# EAGLE design Group_11 (EAGLE 9.6.2)
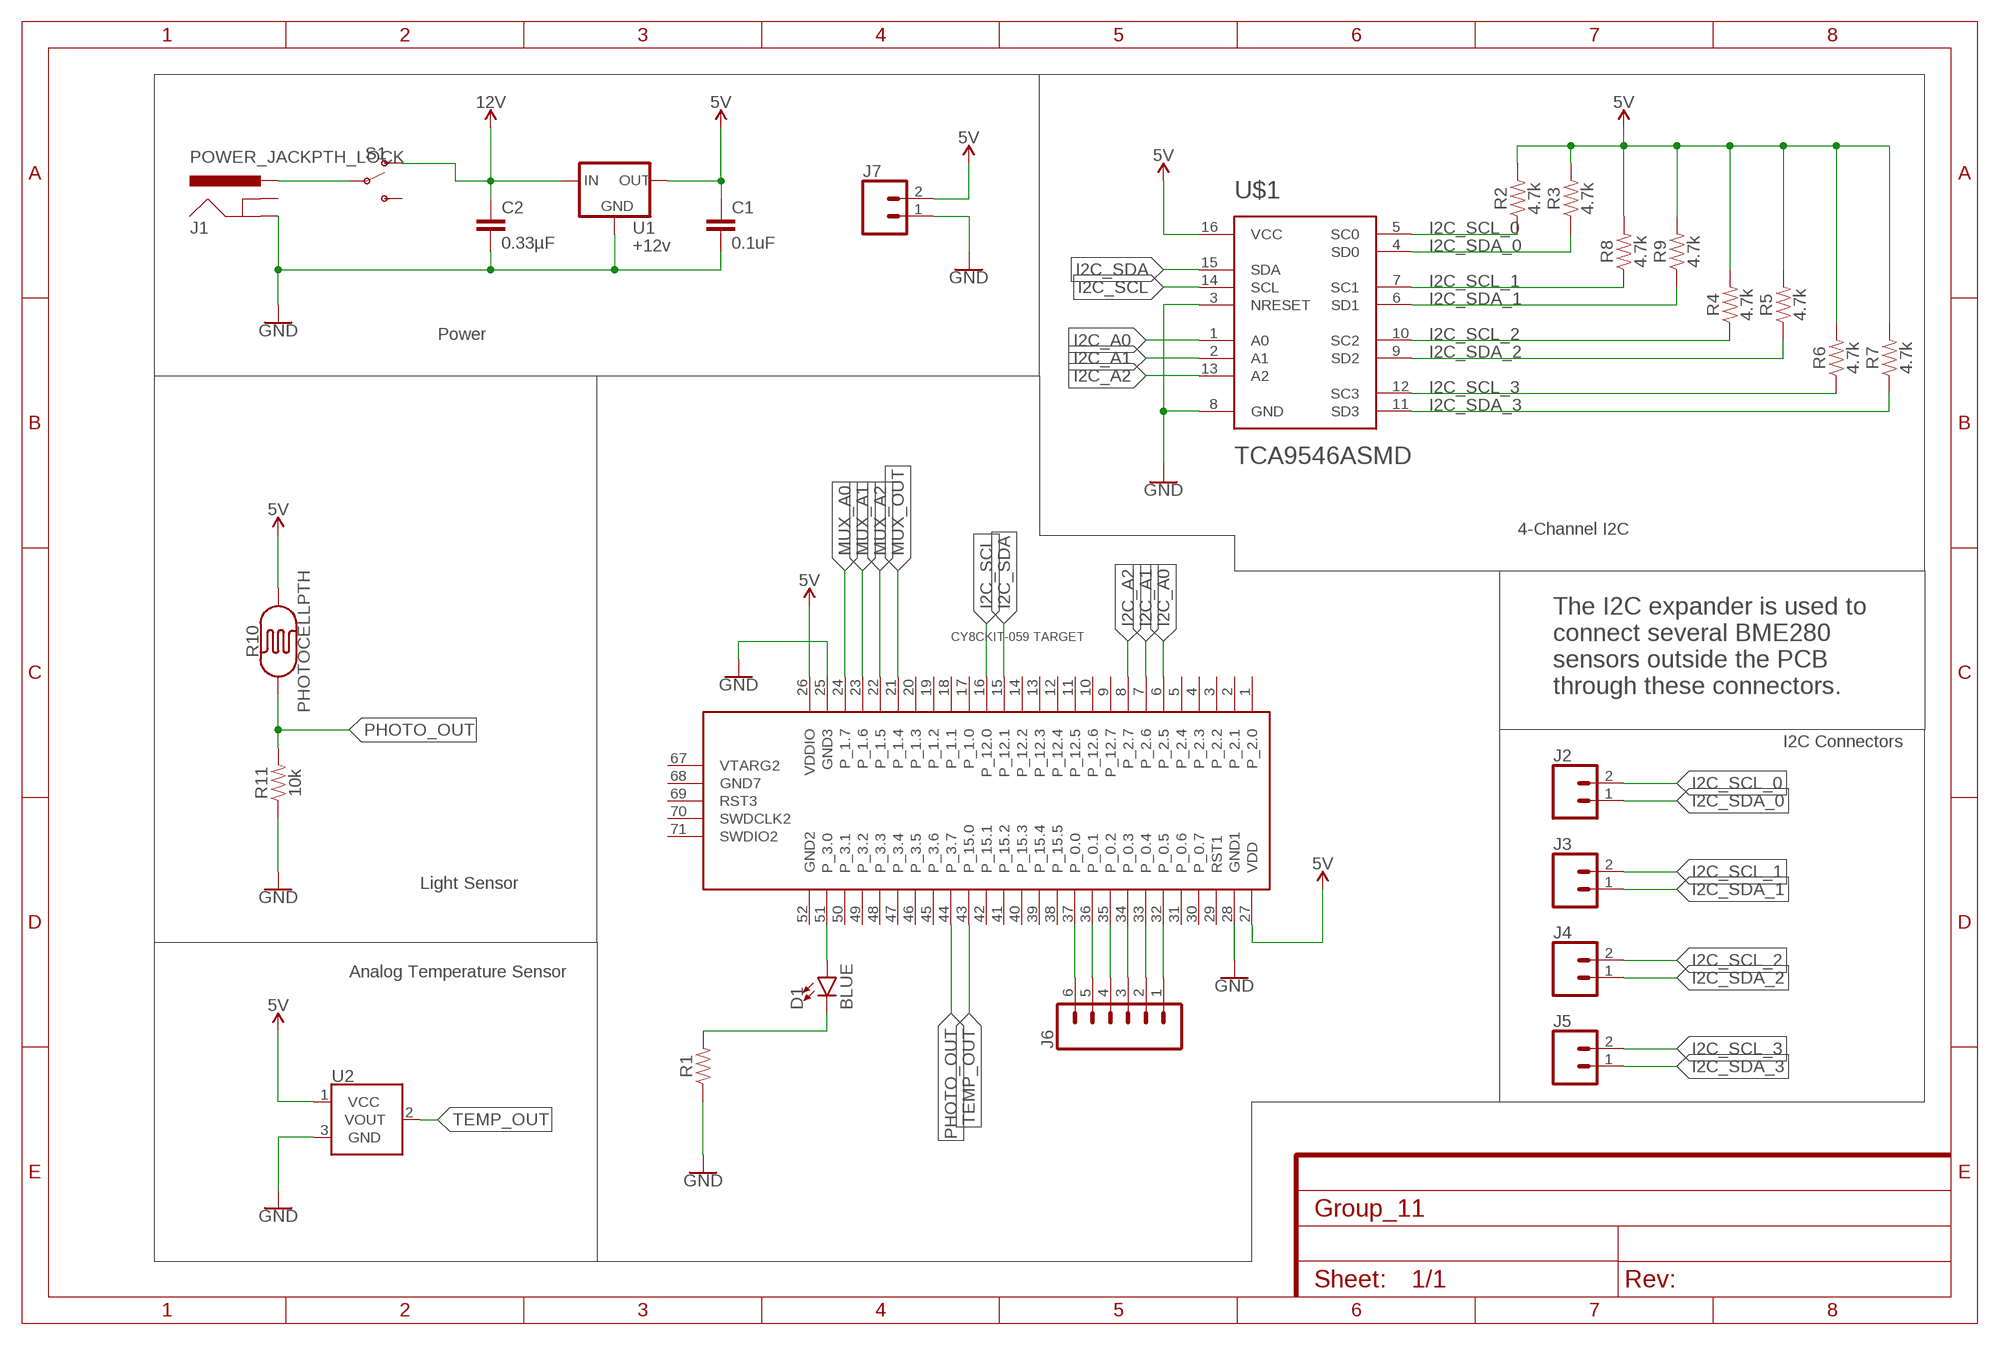
[diagram p0: schematic, sheet 1, part 1 of 2]
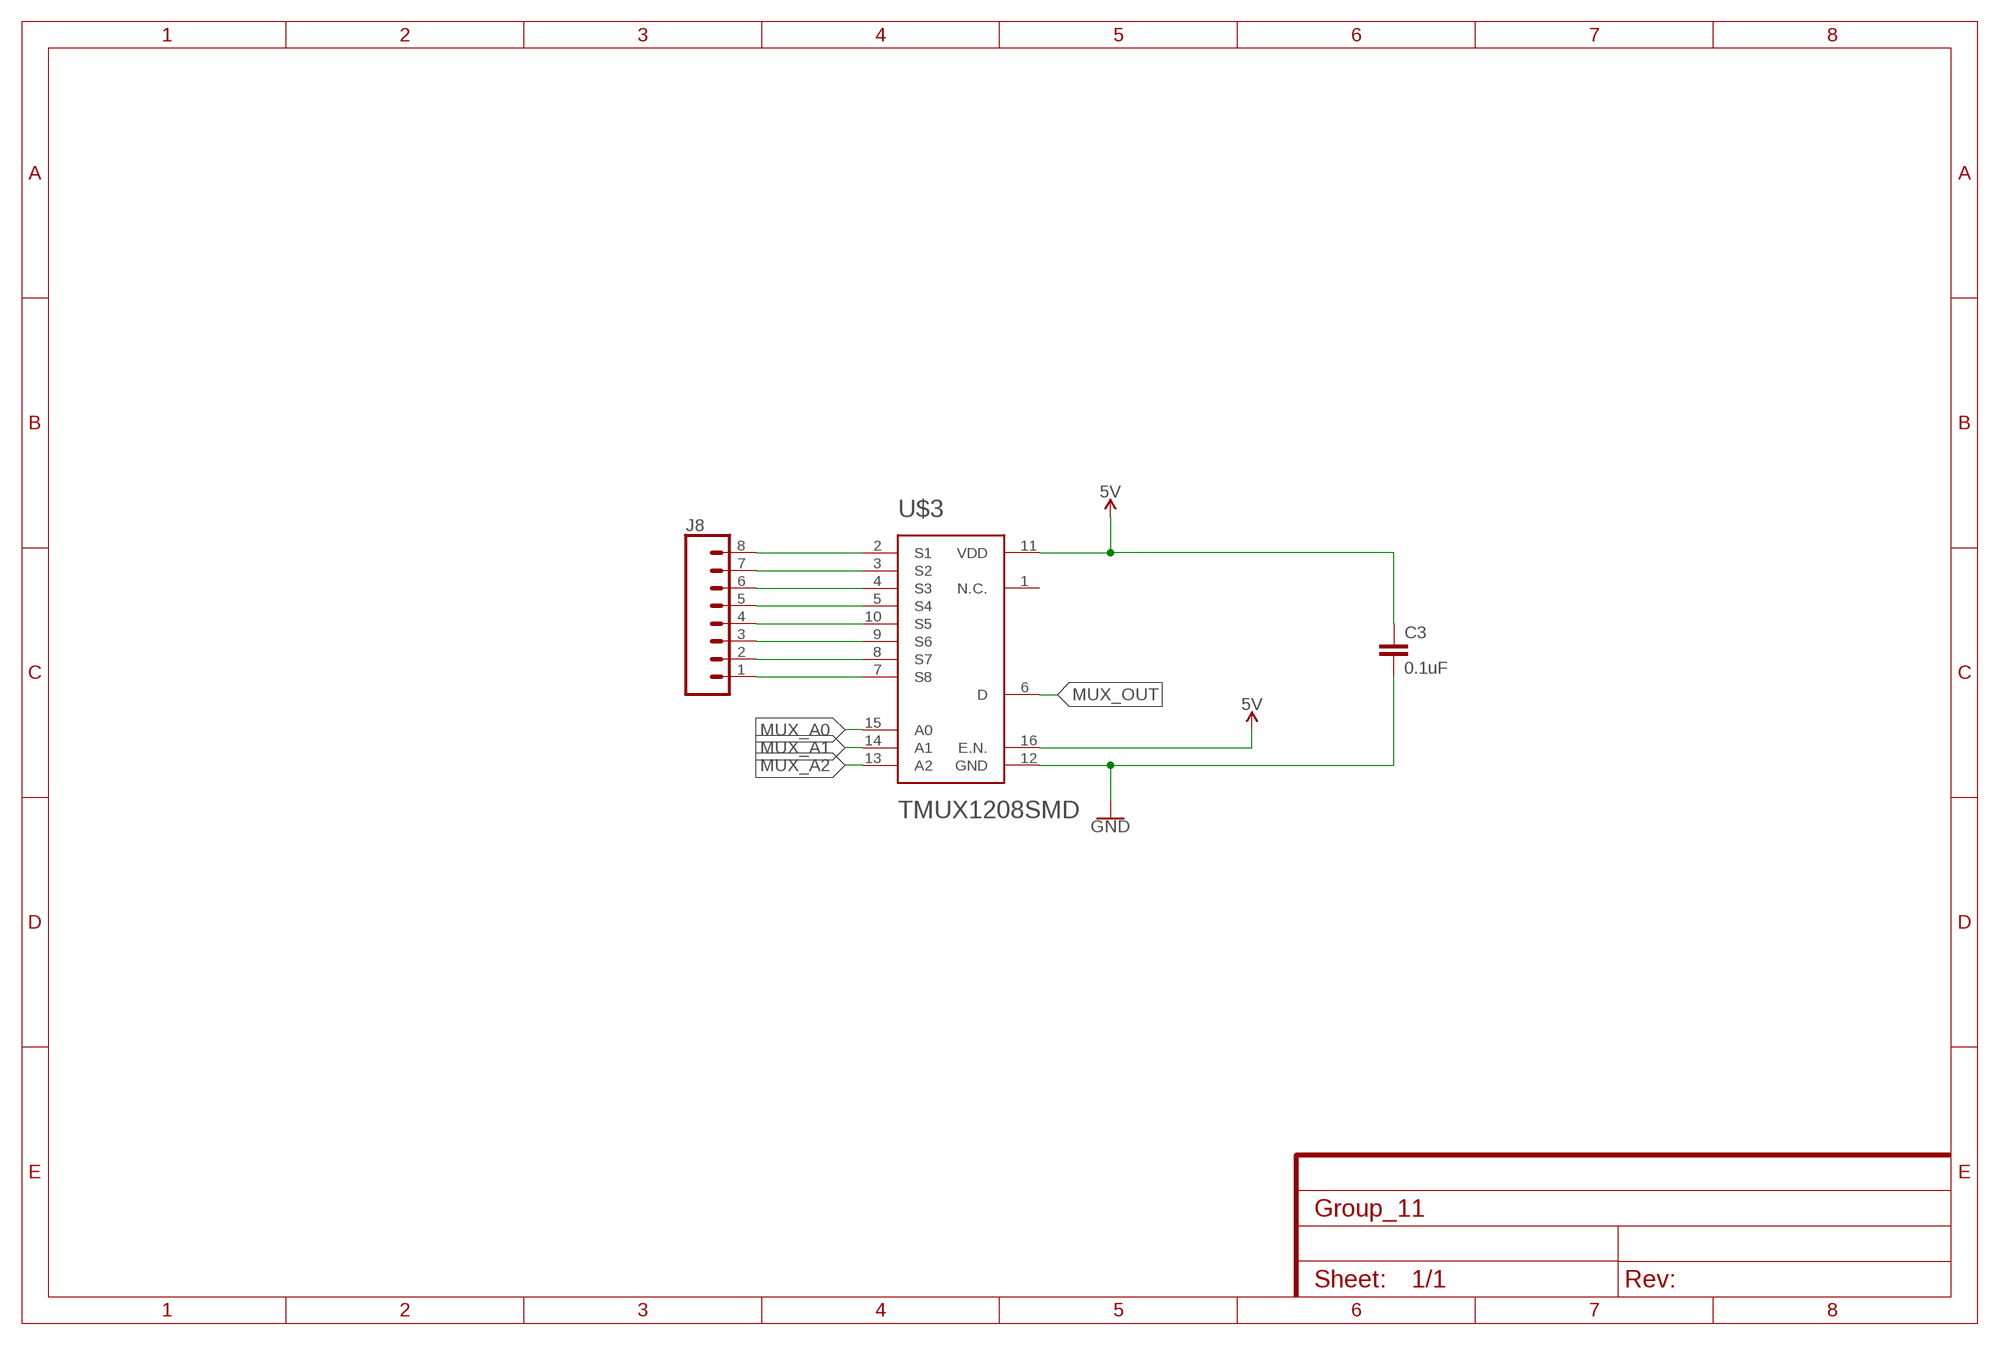
[diagram p1: schematic, sheet 1, part 2 of 2]

## Parts
C1  0.1uF  0.1UF-KIT-EZ-50V-20%  [CAP-PTH-SMALL-KIT]
C2  0.33µF  0.33UF/330NF-0805-50V-10%  [0805]
C3  0.1uF  0.1UF-KIT-EZ-50V-20%  [CAP-PTH-SMALL-KIT]
D1  BLUE  LED-BLUE1206  [LED-1206]
J1  POWER_JACKPTH_LOCK  [POWER_JACK_PTH_LOCK]
J2  CONN_02  [1X02]
J3  CONN_02  [1X02]
J4  CONN_02  [1X02]
J5  CONN_02  [1X02]
J6  CONN_06LOCK  [1X06_LOCK]
J7  CONN_02  [1X02]
J8  CONN_08LOCK  [1X08_LOCK]
R1  RESISTORAXIAL-0.3  [AXIAL-0.3]
R2  4.7k  4.7KOHM-0603-1/10W-1%  [0603]
R3  4.7k  4.7KOHM-0603-1/10W-1%  [0603]
R4  4.7k  4.7KOHM-0603-1/10W-1%  [0603]
R5  4.7k  4.7KOHM-0603-1/10W-1%  [0603]
R6  4.7k  4.7KOHM-0603-1/10W-1%  [0603]
R7  4.7k  4.7KOHM-0603-1/10W-1%  [0603]
R8  4.7k  4.7KOHM-0603-1/10W-1%  [0603]
R9  4.7k  4.7KOHM-0603-1/10W-1%  [0603]
R10  PHOTOCELLPTH  [PHOTOCELL]
R11  10k  10KOHM-0603-1/10W-1%  [0603]
S1  SWITCH-SPDT-PTH-11.6X4.0MM  [SWITCH_SPDT_PTH_11.6X4.0MM]
U1  +12v  V_REG_78XX7812  [TO-252]
U2  TMP36GT9  [TO-92]
U$1  TCA9546ASMD  [TSSOP-16]
U$2  CY8CKIT-059_TARGET  [CY8CKIT-059_TARGET]
U$3  TMUX1208SMD  [QFN16]

## Nets
5V: C1.1 C3.1 J7.2 R2.2 R3.2 R4.2 R5.2 R6.2 R7.2 R8.2 R9.2 R10.2 U1.2(OUT) U2.1(VCC) U$1.16(VCC) U$2.26(VDDIO) U$2.27(VDD) U$3.11(VDD) U$3.16(E.N.)
12V: C2.1 S1.1(O) U1.1(IN)
GND: C1.2 C2.2 C3.2 J1.GND J7.1 R1.P$1 R11.1 U1.3(GND) U2.3(GND) U$1.3(NRESET) U$1.8(GND) U$2.25(GND3) U$2.28(GND1) U$3.12(GND)
I2C_A0: U$1.1(A0) U$2.6(P_2.5)
I2C_A1: U$1.2(A1) U$2.7(P_2.6)
I2C_A2: U$1.13(A2) U$2.8(P_2.7)
I2C_SCL: U$1.14(SCL) U$2.16(P_12.0)
I2C_SCL_0: J2.2 R2.1 U$1.5(SC0)
I2C_SCL_1: J3.2 R8.1 U$1.7(SC1)
I2C_SCL_2: J4.2 R4.1 U$1.10(SC2)
I2C_SCL_3: J5.2 R6.1 U$1.12(SC3)
I2C_SDA: U$1.15(SDA) U$2.15(P_12.1)
I2C_SDA_0: J2.1 R3.1 U$1.4(SD0)
I2C_SDA_1: J3.1 R9.1 U$1.6(SD1)
I2C_SDA_2: J4.1 R5.1 U$1.9(SD2)
I2C_SDA_3: J5.1 R7.1 U$1.11(SD3)
MUX_A0: U$2.24(P_1.7) U$3.15(A0)
MUX_A1: U$2.23(P_1.6) U$3.14(A1)
MUX_A2: U$2.22(P_1.5) U$3.13(A2)
MUX_OUT: U$2.21(P_1.4) U$3.6(D)
N$1: J8.8 U$3.2(S1)
N$2: D1.C R1.P$2
N$3: D1.A U$2.51(P_3.0)
N$4: J6.6 U$2.37(P_0.0)
N$5: J6.5 U$2.36(P_0.1)
N$6: J6.4 U$2.35(P_0.2)
N$7: J6.3 U$2.34(P_0.3)
N$8: J6.2 U$2.33(P_0.4)
N$9: J1.PWR S1.2(P)
N$10: J8.7 U$3.3(S2)
N$11: J8.1 U$3.7(S8)
N$12: J8.2 U$3.8(S7)
N$13: J8.3 U$3.9(S6)
N$14: J8.4 U$3.10(S5)
N$15: J8.5 U$3.5(S4)
N$16: J8.6 U$3.4(S3)
N$17: J6.1 U$2.32(P_0.5)
PHOTO_OUT: R10.1 R11.2 U$2.44(P_3.7)
TEMP_OUT: U2.2(VOUT) U$2.43(P_15.0)
Unconnected: J1.GNDBREAK S1.3(S) U$2.1(P_2.0) U$2.2(P_2.1) U$2.3(P_2.2) U$2.4(P_2.3) U$2.5(P_2.4) U$2.9(P_12.7) U$2.10(P_12.6) U$2.11(P_12.5) U$2.12(P_12.4) U$2.13(P_12.3) U$2.14(P_12.2) U$2.17(P_1.0) U$2.18(P_1.1) U$2.19(P_1.2) U$2.20(P_1.3) U$2.29(RST1) U$2.30(P_0.7) U$2.31(P_0.6) U$2.38(P_15.5) U$2.39(P_15.4) U$2.40(P_15.3) U$2.41(P_15.2) U$2.42(P_15.1) U$2.45(P_3.6) U$2.46(P_3.5) U$2.47(P_3.4) U$2.48(P_3.3) U$2.49(P_3.2) U$2.50(P_3.1) U$2.52(GND2) U$2.67(VTARG2) U$2.68(GND7) U$2.69(RST3) U$2.70(SWDCLK2) U$2.71(SWDIO2) U$3.1(N.C.)

## Notes on the sheet
- Power
- 4-Channel I2C
- The I2C expander is used to 
  connect several BME280 
  sensors outside the PCB 
  through these connectors.
- I2C Connectors
- Light Sensor
- Analog Temperature Sensor

## Library data of the parts
C1 C3 = SparkFun-Capacitors:0.1UF: 0.1µF ceramic capacitors A capacitor is a passive two-terminal electrical component used to store electrical energy temporarily in an electric field.; PROD_ID: CAP-08370
C2 = SparkFun-Capacitors:0.33UF/330NF: 0.33µF/330nF ceramic capacitors A capacitor is a passive two-terminal electrical component used to store electrical energy temporarily in an electric field.; PROD_ID: CAP-08469
D1 = SparkFun-LED:LED-BLUE: Blue SMD LED Used in manufacturing of various products at SparkFun Packages: 0603 - SMD 0603 package [Product Link] <http://www.digikey.com/product-detail/en/SMLE12BC7TT86/511-1589-2-ND/1641808> 1206 - SMD1206 package [Product Link] <http://www.digikey.com/product-detail/en/lite-on-inc/LTST-C150TBKT/160-1643-1-ND/573584> SparkFun Products: ESP8266 Thing-Dev Board <https://www.sparkfun.com/products/13711> RedBoard <https://www.sparkfun.com/products/12757>; PROD_ID: DIO-09911
J1 = SparkFun-Connectors:POWER_JACK: Power Jack Connector This is the standard 5.5mm barrel jack for power. The PTH is the most common, proven, reliable, footprint. The Slot footprint only works if the mill layer is transmitted to the PCB fab house so be warned. Here are the connectors we sell at SparkFun: DC Barrel Power Jack/Connector <https://www.sparkfun.com/products/119> (PRT-00119) DC Barrel Power Jack/Connector (SMD) <https://www.sparkfun.com/products/12748> (PRT-12748) DC Barrel Jack Adapter - Breadboard Compatible <https://www.sparkfun.com/products/10811> (PRT-10811) It is used on this SparkFun product (and many, many others): SparkFun RedBoard - Programmed with Arduino <https://www.sparkfun.com/products/12757> (DEV-12757) Also, if you need a mating power supply or connector, please check these out: Wall Adapter Power Supply - 9VDC 650mA <https://www.sparkfun.com/products/298> (TOL-00298) DC Barrel Jack Adapter - Male <https://www.sparkfun.com/products/10287> (PRT-10287); PROD_ID: CONN-08197; SF_ID: PRT-00119
J2-J5 J7 = SparkFun-Connectors:CONN_02: Multi connection point. Often used as Generic Header-pin footprint for 0.1 inch spaced/style header connections On any of the 0.1 inch spaced packages, you can populate with these: Break Away Headers - Straight <https://www.sparkfun.com/products/116> (PRT-00116) Break Away Male Headers - Right Angle <https://www.sparkfun.com/products/553> (PRT-00553) Female Headers <https://www.sparkfun.com/products/115> (PRT-00115) Break Away Headers - Machine Pin <https://www.sparkfun.com/products/117> (PRT-00117) Break Away Female Headers - Swiss Machine Pin <https://www.sparkfun.com/products/743> (PRT-00743) For SCREWTERMINALS and SPRING TERMINALS visit here: Screw Terimnals on SparkFun.com <https://www.sparkfun.com/search/results?term=Screw+Terminals> (5mm/3.5mm/2.54mm spacing) This device is also useful as a general connection point to wire up your design to another part of your project. Our various solder wires solder well into these plated through hole pads. Hook-Up Wire - Assortment (Stranded, 22 AWG) <https://www.sparkfun.com/products/11375> (PRT-11375) Hook-Up Wire - Assortment (Solid Core, 22 AWG) <https://www.sparkfun.com/products/11367> (PRT-11367) View the entire wire category on our website here <https://www.sparkfun.com/categories/141> Special notes: Molex polarized connector foot print use with: PRT-08233 with associated crimp pins and housings. 2.54_SCREWTERM for use with PRT-10571. 3.5mm Screw Terminal footprints for PRT-08084 5mm Screw Terminal footprints for use with PRT-08432
J6 = SparkFun-Connectors:CONN_06: Multi connection point. Often used as Generic Header-pin footprint for 0.1 inch spaced/style header connections On any of the 0.1 inch spaced packages, you can populate with these: Break Away Headers - Straight <https://www.sparkfun.com/products/116> (PRT-00116) Break Away Male Headers - Right Angle <https://www.sparkfun.com/products/553> (PRT-00553) Female Headers <https://www.sparkfun.com/products/115> (PRT-00115) Break Away Headers - Machine Pin <https://www.sparkfun.com/products/117> (PRT-00117) Break Away Female Headers - Swiss Machine Pin <https://www.sparkfun.com/products/743> (PRT-00743) Arduino Stackable Header - 6 Pin <https://www.sparkfun.com/products/9280> (PRT-09280) For SCREWTERMINALS and SPRING TERMINALS visit here: Screw Terimnals on SparkFun.com <https://www.sparkfun.com/search/results?term=Screw+Terminals> (5mm/3.5mm/2.54mm spacing) This device is also useful as a general connection point to wire up your design to another part of your project. Our various solder wires solder well into these plated through hole pads. Hook-Up Wire - Assortment (Stranded, 22 AWG) <https://www.sparkfun.com/products/11375> (PRT-11375) Hook-Up Wire - Assortment (Solid Core, 22 AWG) <https://www.sparkfun.com/products/11367> (PRT-11367) View the entire wire category on our website here <https://www.sparkfun.com/categories/141>
J8 = SparkFun-Connectors:CONN_08: Multi connection point. Often used as Generic Header-pin footprint for 0.1 inch spaced/style header connections On any of the 0.1 inch spaced packages, you can populate with these: Break Away Headers - Straight <https://www.sparkfun.com/products/116> (PRT-00116) Break Away Male Headers - Right Angle <https://www.sparkfun.com/products/553> (PRT-00553) Female Headers <https://www.sparkfun.com/products/115> (PRT-00115) Break Away Headers - Machine Pin <https://www.sparkfun.com/products/117> (PRT-00117) Break Away Female Headers - Swiss Machine Pin <https://www.sparkfun.com/products/743> (PRT-00743) Arduino Stackable Header - 8 Pin <https://www.sparkfun.com/products/9279> (PRT-09279) For SCREWTERMINALS and SPRING TERMINALS visit here: Screw Terimnals on SparkFun.com <https://www.sparkfun.com/search/results?term=Screw+Terminals> (5mm/3.5mm/2.54mm spacing) This device is also useful as a general connection point to wire up your design to another part of your project. Our various solder wires solder well into these plated through hole pads. Hook-Up Wire - Assortment (Stranded, 22 AWG) <https://www.sparkfun.com/products/11375> (PRT-11375) Hook-Up Wire - Assortment (Solid Core, 22 AWG) <https://www.sparkfun.com/products/11367> (PRT-11367) View the entire wire category on our website here <https://www.sparkfun.com/categories/141> Special notes: Molex polarized connector foot print use with SKU : PRT-08231 with associated crimp pins and housings. 1MM SMD Version SKU: PRT-10208 NOTES ON THE VARIANTS LOCK and LOCK_LONGPADS... This footprint was designed to help hold the alignment of a through-hole component (i.e. 6-pin header) while soldering it into place. You may notice that each hole has been shifted either up or down by 0.005 of an inch from it's more standard position (which is a perfectly straight line). This slight alteration caused the pins (the squares in the middle) to touch the edges of the holes. Because they are alternating, it causes a "brace" to hold the component in place. 0.005 has proven to be the perfect amount of "off-center" position when using our standard breakaway headers. Although looks a little odd when you look at the bare footprint, once you have a header in there, the alteration is very hard to notice. Also,if you push a header all the way into place, it is covered up entirely on the bottom side.
R1 = SparkFun-Resistors:RESISTOR: Generic Resistor Package
R2-R9 = SparkFun-Resistors:4.7KOHM: 4.7kΩ resistor A resistor is a passive two-terminal electrical component that implements electrical resistance as a circuit element. Resistors act to reduce current flow, and, at the same time, act to lower voltage levels within circuits. - Wikipedia; PROD_ID: RES-07857
R10 = SparkFun-Sensors:PHOTOCELL: Photocell (Photodetector, Photo Resistor, CdS) This is a very small light sensor. A photocell changes (also called a photodetector, photo resistor, CdS or photoconductive cell) resistance depending on the amount of light it is exposed to. These little sensors make great ambient light triggers (when light in the room turns on, do something). Datasheet <http://cdn.sparkfun.com/datasheets/Sensors/LightImaging/SEN-09088.pdf> SparkFun Products Mini Photocell <https://www.sparkfun.com/products/9088> (SEN-09088); PROD_ID: COMP-09129; SF_ID: SEN-09088
R11 = SparkFun-Resistors:10KOHM: 10kΩ resistor A resistor is a passive two-terminal electrical component that implements electrical resistance as a circuit element. Resistors act to reduce current flow, and, at the same time, act to lower voltage levels within circuits. - Wikipedia; PROD_ID: RES-00824
S1 = SparkFun-Switches:SWITCH-SPDT: Single Pole, Double Throw (SPDT) Switch Single-pole, double-throw (SPDT) switch. Variant Overview SMD-AYZ0202 Surface Mount DPDT Switch <https://www.sparkfun.com/products/597> (COM-00597) Used on e.g. LilyPad Arduino USB - ATmega32U4 Board <https://www.sparkfun.com/products/12049> PTH-11.6X4.0MM SPDT Mini Power Switch <https://www.sparkfun.com/products/102> (COM-00102) Used on e.g. SparkFun Simon Says - Through-Hole Soldering Kit <https://www.sparkfun.com/products/10547> (KIT-10547) PTH-11.6X4.0MM-KIT KIT version of SPDT Mini Power Switch - Simplifies soldering by removing tStop of switch pins - only one side can be soldered. PTH-11.6X4.0MM-LOCK LOCK version of SPDT Mini Power Switch - Offset pins hold switch in place for easier soldering. SMD-RIGHT-ANGLE Surface Mount Right Angle Switch <https://www.sparkfun.com/products/10860> (COM-10860) Used on e.g. SparkFun ESP8266 Thing <https://www.sparkfun.com/products/13231>; PROD_ID: SWCH-08261; SF_SKU: COM-00102
U1 = SparkFun-IC-Power:V_REG_78XX: Voltage Regulator Standard 78xx regulator. IGO (Input Ground Output). Spark Fun Electronics SKU : COM-00107; PROD_ID: VREG-12370
U2 = SparkFun-Sensors:TMP36: TMP36 Precision Analog °C Temperature Sensor The TMP36 is a low voltage, precision centigrade temperature sensor. It provides a voltage output that is linearly proportional to the Celsius temperature. It also doesn’t require any external calibration to provide typical accuracies of ±1°C at +25°C and ±2°C over the −40°C to +125°C temperature range. We like it because it’s so easy to use: Just give the device a ground and 2.7 to 5.5 VDC and read the voltage on the Vout pin. The output voltage can be converted to temperature easily using the scale factor of 10 mV/°C. Datasheet <http://cdn.sparkfun.com/datasheets/Sensors/Temp/TMP35_36_37.pdf> SparkFun Products Temperature Sensor - TMP36 <https://www.sparkfun.com/products/10988> (SEN-10988) SparkFun Danger Shield <https://www.sparkfun.com/products/11649> (DEV-11649); PROD_ID: IC-09880; SF_ID: SEN-10988
U$1 = Group_11_Library:TCA9546A: TCA9546A The TCA9546A is a quad bidirectional translating switch controlled via the I^2C bus. The SCL/SDA upstream pair fans out to four downstream pairs, or channels. Any individual SCn/SDn channel or combination of channels can be selected, determined by the contents of the programmable control register Available Packages: TSSOP-16 SOIC-16
U$2 = CY8KIT-059:CY8CKIT-059_TARGET: CY8CKIT-059 Target This device exposes the pins of the target section of the CY8CKIT-059, including the programming section, that must be connected to the KitProg in order to program the target micro-controller.
U$3 = Group_11_Library:TMUX1208: TMUX1208 The TMUX1208 and TMUX1209 are general purpose complementary metal-oxide semiconductor (CMOS) multiplexers (MUX). The TMUX1208 offers 8:1 singleended channels, while the TMUX1209 offers differential 4:1 or dual 4:1 single-ended channels. Wide operating supply of 1.08 V to 5.5 V allows for use in a broad array of applications from personal electronics to building automation applications. The device supports bidirectional analog and digital signals on the source (Sx) and drain (D) pins ranging from GND to VDD Available packages: QFN16

## Board
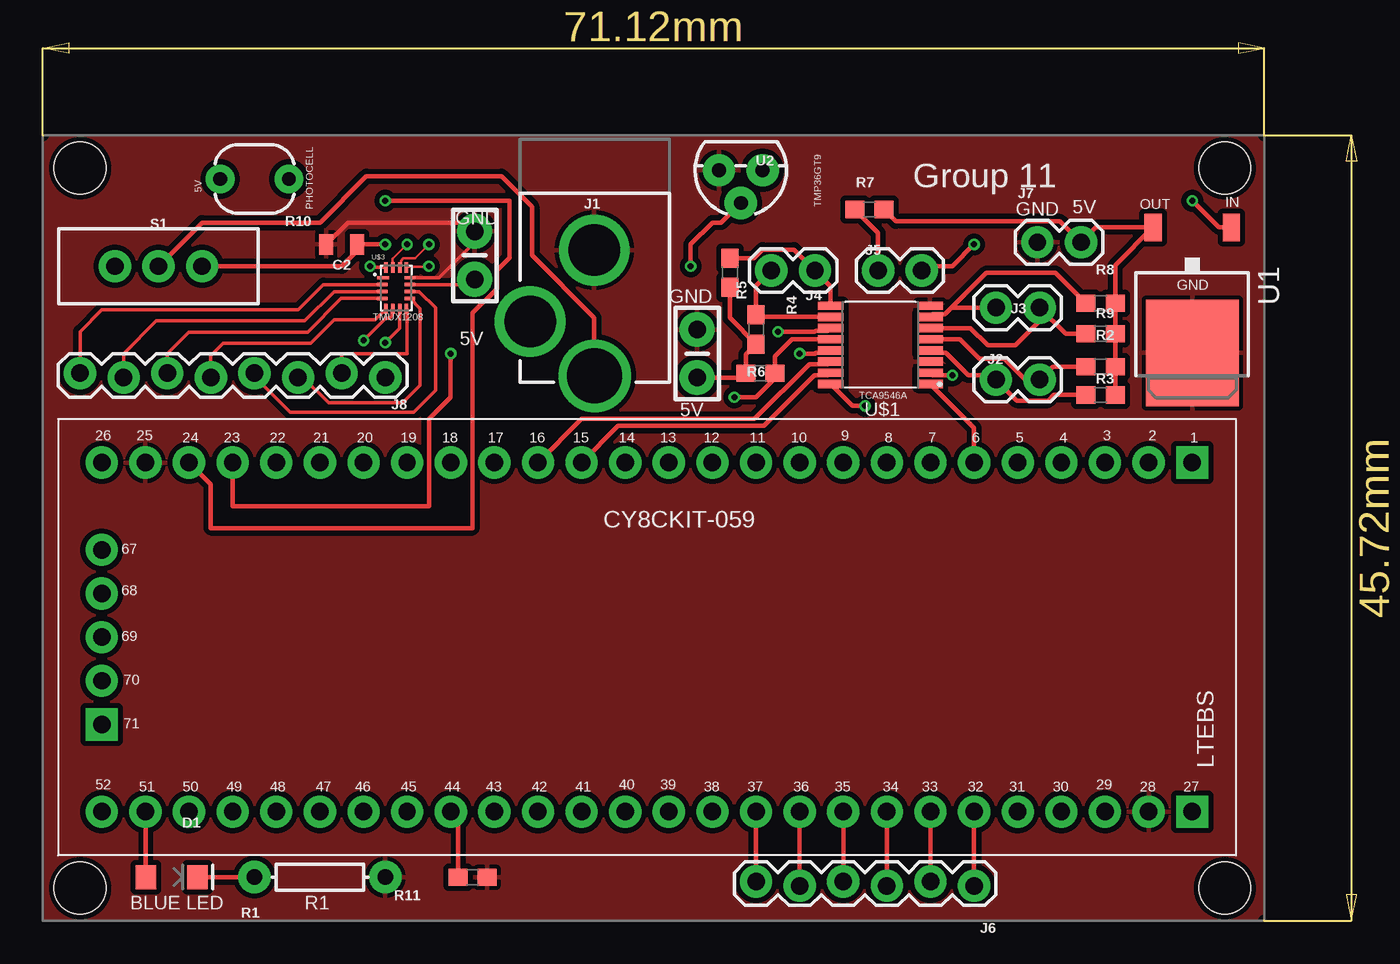
[diagram p2: board, top side]
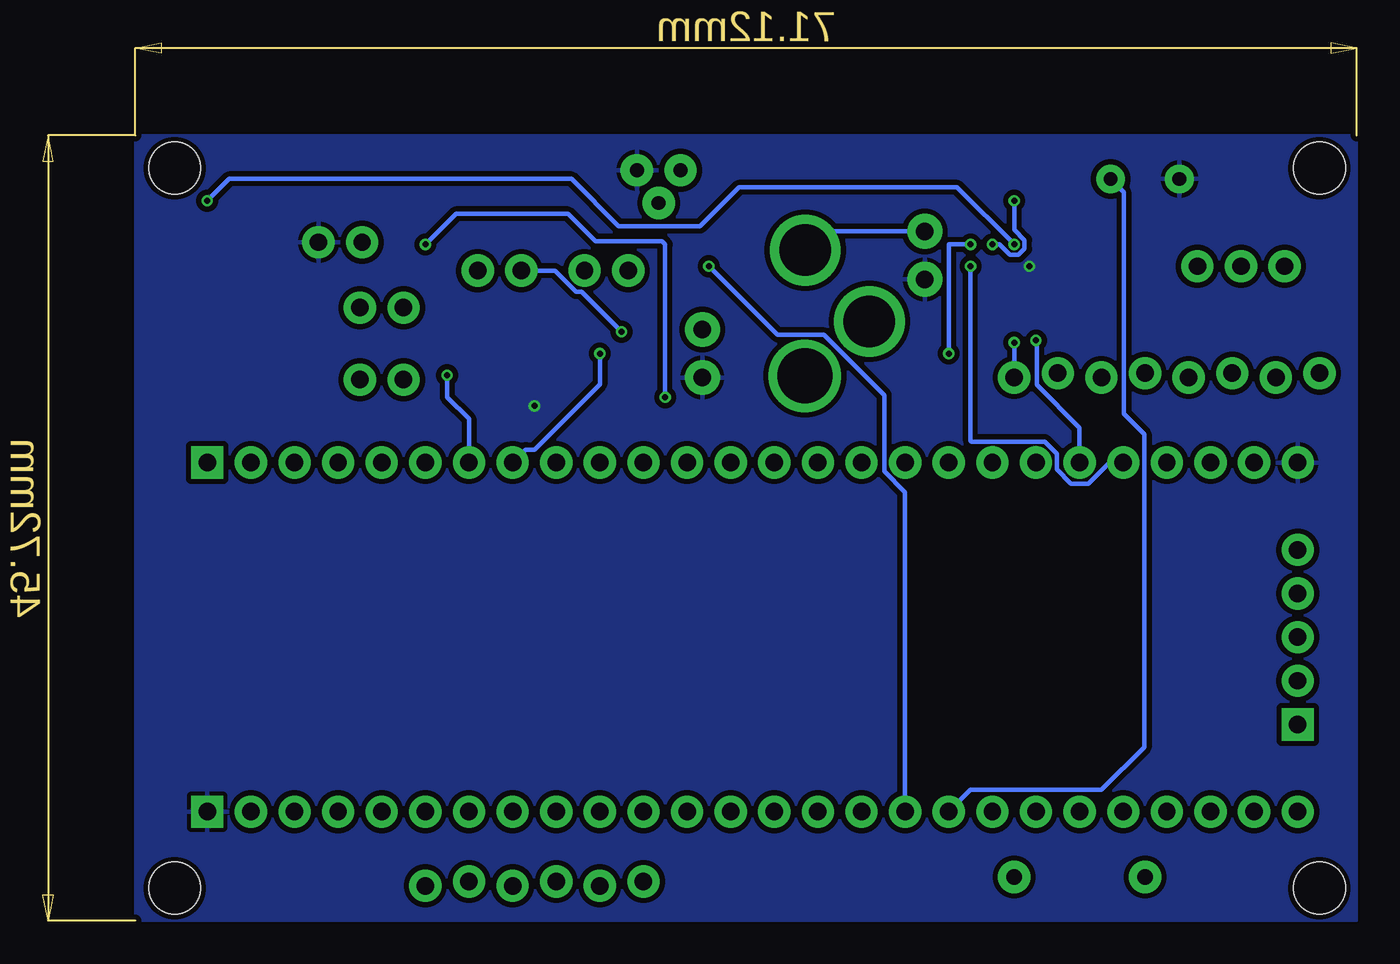
[diagram p3: board, bottom side, seen from below]

Size 76.5 x 51.1 mm. Coordinates in mm from the lower left corner, seen from the top.
Copper layers (1*16): Top 0.035mm / dielectric 1.5mm / Bottom 0.035mm
Design rules "Group_11": minimum track width 6mil, minimum drill 0.2mm, track to track 6mil, track to pad 6mil, pad to pad 6mil, via to via 6mil, smd to smd 6mil, copper to edge 8mil, drill to drill 6mil, minimum pad ring 8mil, minimum via ring 6mil, stop-mask expansion 4mil, vias tented up to drill 0mil, thermal gap 10mil
Holes 3 mm at 2.16,1.91 68.83,1.91 2.16,43.81 68.83,43.81

### Footprints (pad centres in the part's own frame; a part is rotated, then mirrored left to right if it is on the bottom)
CAP-PTH-SMALL-KIT = drill 1.016 pad 2.032: 1 -1.397,0; 2 1.397,0
0805 = smd 0.8 x 1.2: 1 -0.9,0; 2 0.9,0
LED-1206 = smd 1.2 x 1.4: A -1.5,0; C 1.5,0
POWER_JACK_PTH_LOCK = drill 2.997 pad 4.115: GND 0.025,6.557; GNDBREAK 3.762,10.7 | drill 3.2 pad 4.115: PWR 0,13.878
1X02 = drill 1.016 pad 1.88: 1 0,0; 2 2.54,0
1X06_LOCK = drill 1.016 pad 1.88: 1 0,0; 2 2.54,-0.254; 3 5.08,0; 4 7.62,-0.254; 5 10.16,0; 6 12.7,-0.254
1X08_LOCK = drill 1.016 pad 1.88: 1 0,0.127; 2 2.54,-0.127; 3 5.08,0.127; 4 7.62,-0.127; 5 10.16,0.127; 6 12.7,-0.127; 7 15.24,0.127; 8 17.78,-0.127
AXIAL-0.3 = drill 0.9 pad 1.88: P$1 -3.81,0; P$2 3.81,0
0603 = smd 1.1 x 1: 1 -0.85,0; 2 0.85,0
PHOTOCELL = drill 0.8 pad 1.676: 1 -2,0; 2 2,0
SWITCH_SPDT_PTH_11.6X4.0MM = drill 1.016 pad 1.88: 1 0,2.54; 2 0,0; 3 0,-2.54
TO-252 = smd 1 x 1.6: 1 -2.28,-4.8; 2 2.28,-4.8 | smd 5.4 x 6.2: 3 0,2.5
TO-92 = drill 0.813 pad 1.88: 1 -1.27,0; 2 0,1.905; 3 1.27,0
TSSOP-16 = smd 1.5 x 0.45: 1 -2.9,2.275; 2 -2.9,1.625; 3 -2.9,0.975; 4 -2.9,0.325; 5 -2.9,-0.325; 6 -2.9,-0.975; 7 -2.9,-1.625; 8 -2.9,-2.275; 9 2.9,-2.275; 10 2.9,-1.625; 11 2.9,-0.975; 12 2.9,-0.325; 13 2.9,0.325; 14 2.9,0.975; 15 2.9,1.625; 16 2.9,2.275
CY8CKIT-059_TARGET = drill 1.016 pad 1.876 square: 1 30.48,8.89; 27 30.48,-11.43; 71 -33.02,-6.35 | drill 1.016 pad 1.876: 2 27.94,8.89; 3 25.4,8.89; 4 22.86,8.89; 5 20.32,8.89; 6 17.78,8.89; 7 15.24,8.89; 8 12.7,8.89; 9 10.16,8.89; 10 7.62,8.89; 11 5.08,8.89; 12 2.54,8.89; 13 0,8.89; 14 -2.54,8.89; 15 -5.08,8.89; 16 -7.62,8.89; 17 -10.16,8.89; 18 -12.7,8.89; 19 -15.24,8.89; 20 -17.78,8.89; 21 -20.32,8.89; 22 -22.86,8.89; 23 -25.4,8.89; 24 -27.94,8.89; 25 -30.48,8.89; 26 -33.02,8.89; 28 27.94,-11.43; 29 25.4,-11.43; 30 22.86,-11.43; 31 20.32,-11.43; 32 17.78,-11.43; 33 15.24,-11.43; 34 12.7,-11.43; 35 10.16,-11.43; 36 7.62,-11.43; 37 5.08,-11.43; 38 2.54,-11.43; 39 0,-11.43; 40 -2.54,-11.43; 41 -5.08,-11.43; 42 -7.62,-11.43; 43 -10.16,-11.43; 44 -12.7,-11.43; 45 -15.24,-11.43; 46 -17.78,-11.43; 47 -20.32,-11.43; 48 -22.86,-11.43; 49 -25.4,-11.43; 50 -27.94,-11.43; 51 -30.48,-11.43; 52 -33.02,-11.43; 67 -33.02,3.81; 68 -33.02,1.27; 69 -33.02,-1.27; 70 -33.02,-3.81
QFN16 = smd 0.7 x 0.2: 1 -0.75,0.6 | smd 0.6 x 0.2: 2 -0.8,0.2; 3 -0.8,-0.2; 4 -0.8,-0.6; 9 0.8,-0.6; 10 0.8,-0.2; 11 0.8,0.2; 12 0.8,0.6 | smd 0.2 x 0.6: 5 -0.6,-1.2; 6 -0.2,-1.2; 7 0.2,-1.2; 8 0.6,-1.2; 13 0.6,1.2; 14 0.2,1.2; 15 -0.2,1.2; 16 -0.6,1.2

### Placement (x,y rotation side)
C1  25.15,38.73 90 top
C2  17.4,39.37 180 top
C3  38.1,33.02 90 top
D1  7.49,2.54 0 top
J1  32.13,45.59 180 top
J2  55.5,31.5 0 top
J3  58.04,35.69 180 top
J4  44.96,37.85 180 top
J5  48.64,37.85 0 top
J6  54.23,2.03 180 top
J7  57.91,39.5 0 top
J8  19.94,31.75 180 top
R1  16.13,2.54 180 top
R2  61.59,32.26 0 top
R3  61.59,30.61 0 top
R4  41.53,34.42 270 top
R5  40.01,37.72 270 top
R6  41.78,31.88 180 top
R7  48.13,41.4 0 top
R8  61.59,35.94 0 top
R9  61.59,34.16 0 top
R10  12.32,43.18 180 top
R11  25.02,2.54 180 top
S1  6.73,38.1 270 top
U1  66.93,35.56 180 top
U2  40.64,43.69 180 top
U$1  48.77,33.53 180 top
U$2  36.45,17.78 0 top
U$3  20.57,36.83 0 top

### Tracks (layer width: path | path; a pad name or v marks a point on that pad's centre or on a via)
5V  (via drill 0.35)
  Top 0.203: U$3.11 24.84,37.03 C1.1 | U$3.16 19.12,38.03 v19.05,38.1
  Top 0.254: R3.2 R2.2 R9.2 R8.2 62.45,38.16 U1.2 61.31,40.36 J7.2 59.23,40.72 49.67,40.72 R7.2 | U$1.16 47.15,29.97 v47.88,29.97 | C3.1 40.68,31.62 R6.2 40.93,32.97 R4.2 40.01,35.09 R5.2
  pour Bottom (isolate 0.305): 0,0 0,45.72 71.12,45.72 71.12,0
12V  (via drill 0.35)
  Top 0.254: S1.1 17.4,38.1 18.3,39 C2.1 v19.94,39.37 | U1.1 68.48,40.36 v66.93,41.91
  Bottom 0.254: v19.94,39.37 23.27,42.7 35.97,42.7 38.23,40.44 42.98,40.44 45.72,43.18 65.66,43.18 v66.93,41.91
GND
  Top 0.203: U$3.12 23.08,37.43 25.15,39.5 C1.2
  Top 0.254: C2.2 17.77,40.64 24.64,40.64 C1.2
  Bottom 0.254: C1.2 31.01,40.13 J1.GND
  pour Top (isolate 0.305): 0,0 0,45.72 71.12,45.72 71.12,0
I2C_A0
  Top 0.254: U$1.1 54.23,28.69 U$2.6
I2C_A1  (via drill 0.35)
  Top 0.254: U$1.2 51.81,31.76 52.53,31.76 52.53,31.75 v52.96,31.75
  Bottom 0.254: v52.96,31.75 52.96,30.48 51.69,29.21 U$2.7
I2C_A2  (via drill 0.35)
  Top 0.254: U$1.13 45.72,33.06 45.01,33.06 44.97,33.02 v44.07,33.02
  Bottom 0.254: v44.07,33.02 44.07,31.24 47.88,27.43 48.39,27.43 U$2.8
I2C_SCL
  Top 0.254: U$2.16 31.37,29.21 41.43,29.21 44.63,32.41 45.72,32.41 U$1.14
I2C_SCL_0
  Top 0.254: U$1.5 53.4,33.85 54.53,32.72 56,32.72 57.22,31.5 J2.2 58.8,32.26 R2.1
I2C_SCL_1
  Top 0.254: 52.92,35.69 54.95,37.72 58.97,37.72 R8.1 | U$1.7 51.81,35.3 52.53,35.3 52.92,35.69 | 52.92,35.69 J3.2
I2C_SCL_2
  Top 0.254: J4.2 41.53,36.96 R4.1 41.64,35.15 U$1.10
I2C_SCL_3  (via drill 0.35)
  Top 0.254: U$1.12 43.63,33.85 42.63,32.85 R6.1 42.63,31.58 41.53,30.48 v40.26,30.48 | J5.2 51.44,38.1 52.96,38.1 v54.23,39.37
  Bottom 0.254: v40.26,30.48 40.26,39.37 40.44,39.55 44.32,39.55 45.92,41.15 52.45,41.15 v54.23,39.37
I2C_SDA
  Top 0.254: U$2.15 33.5,28.8 41.98,28.8 44.93,31.76 45.72,31.76 U$1.15
I2C_SDA_0
  Top 0.254: U$1.4 51.81,33.06 52.58,33.06 53.89,31.75 55.24,31.75 J2.1 56.72,30.28 58.54,30.28 58.87,30.61 R3.1
I2C_SDA_1
  Top 0.254: U$1.6 54.02,34.5 55.02,33.5 56.64,33.5 58.04,34.9 J3.1 59.56,34.16 R9.1
I2C_SDA_2
  Top 0.254: U$1.9 45.87,36.94 J4.1 43.74,39.06 41.91,39.06 41.42,38.57 R5.1
I2C_SDA_3  (via drill 0.35)
  Top 0.254: U$1.11 45.72,34.36 45.01,34.36 44.94,34.29 v42.8,34.29 | R7.1 48.64,40.04 J5.1
  Bottom 0.254: v42.8,34.29 45.14,36.63 45.46,36.63 46.68,37.85 J5.1
MUX_A0  (via drill 0.35)
  Top 0.152: v21.21,39.37 20.37,38.53 U$3.15
  Top 0.254: U$2.24 9.78,25.4 9.78,22.86 25.02,22.86 25.02,35.38 26.44,36.8 26.44,37.87 27.18,38.61 27.18,41.91 v19.94,41.91
  Bottom 0.254: v21.21,39.37 20.8,39.37 20.19,38.76 19.69,38.76 19.33,39.12 19.33,39.62 19.94,40.23 v19.94,41.91
MUX_A1  (via drill 0.35)
  Top 0.152: v22.48,39.37 21.67,38.56 20.98,38.56 20.84,38.42 20.84,38.1 U$3.14
  Top 0.254: U$2.23 11.05,24.13 22.48,24.13 22.48,29.21 23.75,30.48 v23.75,33.02
  Bottom 0.254: v23.75,33.02 23.75,39.37 v22.48,39.37
MUX_A2  (via drill 0.35)
  Top 0.152: U$3.13 21.17,38.06 22.44,38.06 v22.48,38.1
  Bottom 0.254: U$2.22 14.41,26.67 15.62,25.45 16.63,25.45 17.45,26.27 17.45,27.17 18.16,27.89 22.43,27.89 22.48,27.94 v22.48,38.1
MUX_OUT  (via drill 0.35)
  Top 0.203: U$3.6 20.33,35.59 20.33,35.23 20.18,35.08 19.96,35.08 v18.67,33.78
  Bottom 0.254: U$2.21 16.13,28.71 18.62,31.2 18.62,33.73 v18.67,33.78
N$1
  Top 0.203: J8.8 2.16,34.29 3.43,35.56 14.86,35.56 16.33,37.03 U$3.2
N$2
  Top 0.254: D1.C R1.P$2
N$3
  Top 0.254: U$2.51 5.99,6.33 D1.A
N$4
  Top 0.254: J6.6 U$2.37
N$5
  Top 0.254: U$2.36 J6.5
N$6
  Top 0.254: U$2.35 J6.4
N$7
  Top 0.254: U$2.34 J6.3
N$8
  Top 0.254: U$2.33 J6.2
N$9
  Top 0.254: S1.2 9.27,40.64 16.13,40.64 18.83,43.34 26.7,43.34 28.47,41.57 28.47,38.73 32.1,35.1 32.1,31.74 J1.PWR
N$10
  Top 0.203: U$3.3 16.95,36.63 15.24,34.92 6.6,34.92 4.7,33.02 J8.7
N$11  (via drill 0.35)
  Top 0.203: v19.94,33.66 20.77,34.49 U$3.7
  Bottom 0.254: v19.94,33.66 J8.1
N$12
  Top 0.203: J8.2 17.4,33.02 21.21,33.02 21.21,35.59 U$3.8
N$13
  Top 0.203: J8.3 15.17,31.62 16.64,30.15 20.95,30.15 21.96,31.16 21.96,35.64 U$3.9
N$14
  Top 0.203: U$3.10 21.92,36.63 22.88,35.67 22.88,30.88 21.59,29.59 14.4,29.59 12.32,31.68 J8.4
N$15
  Top 0.203: J8.5 9.78,32.89 10.49,33.6 15.58,33.6 16.97,34.99 19.34,34.99 U$3.5
N$16
  Top 0.203: J8.6 7.24,33.02 8.48,34.27 15.41,34.27 17.37,36.23 U$3.4
N$17
  Top 0.254: U$2.32 J6.1
PHOTO_OUT
  Top 0.254: U$2.44 24.17,5.93 R11.2
  Bottom 0.254: R10.1 13.56,42.42 13.56,29.5 12.37,28.32 12.37,10.11 14.86,7.62 22.48,7.62 U$2.44
TEMP_OUT  (via drill 0.35)
  Top 0.254: U2.2 39.5,40.64 38.99,40.64 37.72,39.37 37.72,39.2 37.72,39.19 v37.72,38.1
  Bottom 0.254: U$2.43 26.29,24.95 27.51,26.17 27.51,30.59 31.02,34.1 33.72,34.1 v37.72,38.1

### Text on the board
tPlace: Group 11 | 5V | TMP36GT9 | IN | PHOTOCELL | GND | GND | 5V | OUT | GND | GND | TMUX1208 | 5V | TCA9546A | 5V | 26 | 25 | 24 | 23 | 22 | 21 | 20 | 19 | 18 | 17 | 16 | 15 | 14 | 13 | 12 | 11 | 10 | 9 | 8 | 7 | 6 | 5 | 4 | 3 | 2 | 1 | CY8CKIT-059 | 67 | 68 | 69 | 70 | 71 | LTEBS | 52 | 40 | 39 | 29 | 51 | 50 | 49 | 48 | 47 | 46 | 45 | 44 | 43 | 42 | 41 | 38 | 37 | 36 | 35 | 34 | 33 | 32 | 31 | 30 | 28 | 27 | BLUE LED | R1